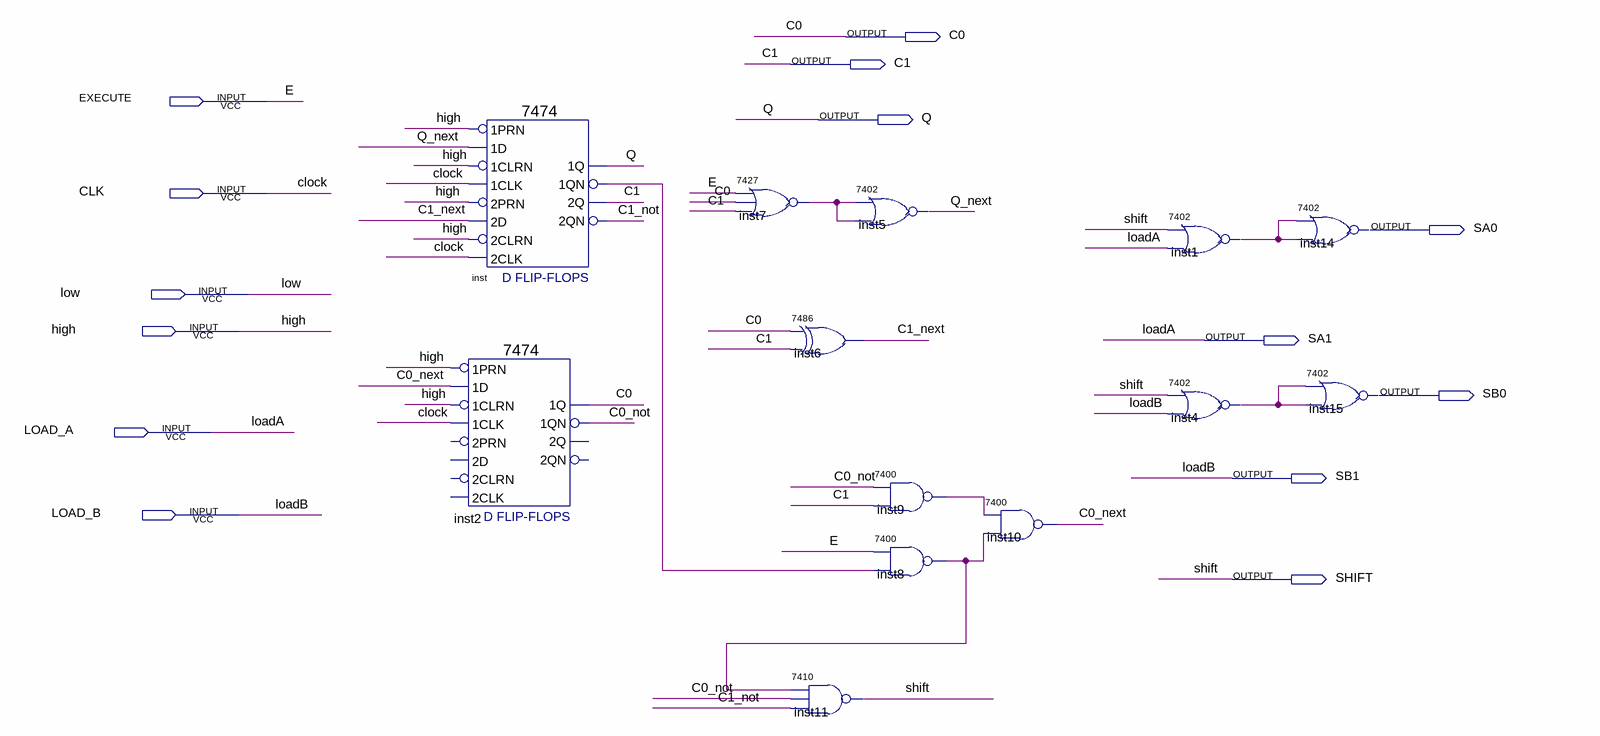
[diagram p0: schematic sheet]
// Quartus schematic control_unit.bdf as structural Verilog: 13 symbols, 14 pins
module control_unit (
  input  EXECUTE,
  input  CLK,
  input  low,
  input  high,
  input  LOAD_A,
  input  LOAD_B,
  output C0,
  output C1,
  output Q,
  output SA0,
  output SA1,
  output SB0,
  output SB1,
  output SHIFT
);

  wire C0_next, C0_not, C1_next, C1_not, inst1_1, inst4_1, inst7_1, inst8_1, inst9_1, inst_1qn, Q_next;

  \7474  inst2 (
    .\1CLK (CLK), .\1D (C0_next), .\1PRN (high), .\1CLRN (high), .\1QN (C0_not), .\1Q (C0));  // open: 2D, 2PRN, 2CLK, 2CLRN, 2Q, 2QN
  \7474  inst (
    .\2D (C1_next), .\2PRN (high), .\1CLK (CLK), .\1D (Q_next), .\1PRN (high), .\2CLK (CLK), .\2CLRN (high),
    .\1CLRN (high), .\1QN (inst_1qn), .\2Q (C1), .\2QN (C1_not), .\1Q (Q));
  \7427  inst7 (.\4 (C1), .\3 (C0), .\2 (EXECUTE), .\1 (inst7_1));
  \7486  inst6 (.\2 (C0), .\3 (C1), .\1 (C1_next));
  \7410  inst11 (.\2 (inst8_1), .\3 (C0_not), .\4 (C1_not), .\1 (SHIFT));
  \7402  inst5 (.\2 (inst7_1), .\3 (inst7_1), .\1 (Q_next));
  \7400  inst9 (.\3 (C1), .\2 (C0_not), .\1 (inst9_1));
  \7400  inst8 (.\3 (inst_1qn), .\2 (EXECUTE), .\1 (inst8_1));
  \7400  inst10 (.\3 (inst8_1), .\2 (inst9_1), .\1 (C0_next));
  \7402  inst1 (.\2 (SHIFT), .\3 (LOAD_A), .\1 (inst1_1));
  \7402  inst4 (.\2 (SHIFT), .\3 (LOAD_B), .\1 (inst4_1));
  \7402  inst14 (.\2 (inst1_1), .\3 (inst1_1), .\1 (SA0));
  \7402  inst15 (.\2 (inst4_1), .\3 (inst4_1), .\1 (SB0));

  assign SA1 = LOAD_A;
  assign SB1 = LOAD_B;

  // Other names for the same wires on the sheet: clock = CLK; E = EXECUTE; loadA = LOAD_A; loadB = LOAD_B
endmodule
